# EAGLE schematic naiLED_eagle (EAGLE 7.1.0)
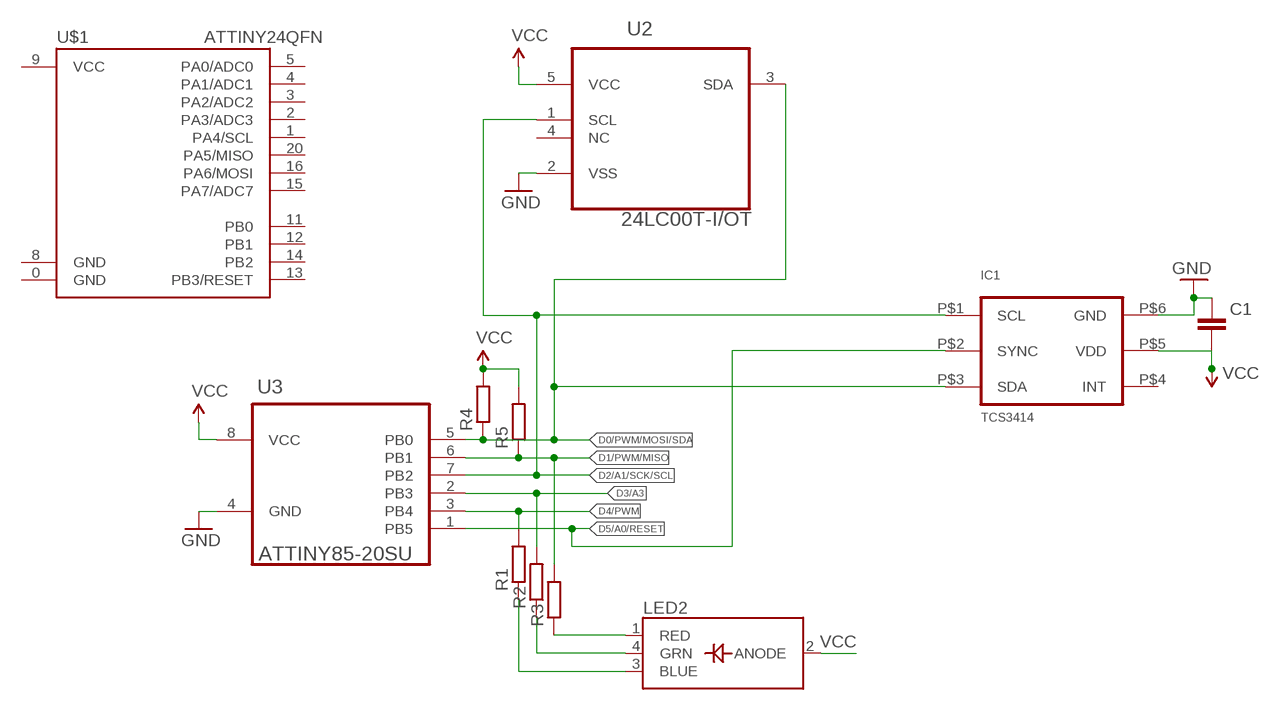
[diagram p0: schematic, sheet 1]

## Parts
C1  CAPACITOR_NPOL-0402  [C402]
IC1  TCS3414  [DFN-6PIN]
LED2  LED_RGB_PLCC4  [RGBLED_PLCC4]
R1  RESISTOR-0402  [R402]
R2  RESISTOR-0402  [R402]
R3  RESISTOR-0402  [R402]
R4  RESISTOR-0402  [R402]
R5  RESISTOR-0402  [R402]
U2  24LC00T-I/OT  [SOT95P290X145-5N]
U3  ATTINY85-20SU  [SOIC127P798X216-8N]
U$1  ATTINY24QFN  [QFN20]

## Nets
D0/PWM/MOSI/SDA: IC1.P$3(SDA) R4.1 U2.3(SDA) U3.5(PB0)
D1/PWM/MISO: R3.2 R5.1 U3.6(PB1)
D2/A1/SCK/SCL: IC1.P$1(SCL) U2.1(SCL) U3.7(PB2)
D3/A3: R2.2 U3.2(PB3)
D4/PWM: R1.2 U3.3(PB4)
D5/A0/RESET: IC1.P$2(SYNC) U3.1(PB5)
GND: C1.2 IC1.P$6(GND) U2.2(VSS) U3.4(GND)
N$1: LED2.1(RED) R3.1
N$2: LED2.4(GRN) R2.1
N$3: LED2.3(BLUE) R1.1
VCC: C1.1 IC1.P$5(VDD) LED2.2(ANODE) R4.2 R5.2 U2.5(VCC) U3.8(VCC)
Unconnected: IC1.P$4(INT) U2.4(NC) U$1.0(GND) U$1.1(PA4/SCL) U$1.2(PA3/ADC3) U$1.3(PA2/ADC2) U$1.4(PA1/ADC1) U$1.5(PA0/ADC0) U$1.8(GND) U$1.9(VCC) U$1.11(PB0) U$1.12(PB1) U$1.13(PB3/RESET) U$1.14(PB2) U$1.15(PA7/ADC7) U$1.16(PA6/MOSI) U$1.20(PA5/MISO)

## Library data of the parts
C1 = dp_devices:CAPACITOR_NPOL: Non-Polarized capacitor in various packages
IC1 = yair_r:TCS3414: Color Light-to-Digital Converter With SYNC Input for Color Sensing Synchronization and In-Package IR Blocking Filter (CS Package Only) Vdd I2C http://www.ams.com/eng/content/download/250258/975997/TCS3404_TCS3414-A.pdf
LED2 = microbuilder:LED_RGB_PLCC4: RGB LED - PLCC4 Cree 20mA Common Anode Digikey: CLV1A-FKB-CJ1M1F1BB7R4S3CT-ND Red: 2.6V Vf, 550mcd Green: 3.2V Vf, 850mcd Blue: 3.2V Vf, 320mcd
R1-R5 = dp_devices:RESISTOR
U2 = Microchip-24LCxxx:24LC00T-I/OT: IC, EEPROM 128BIT SERIAL 400KHZ SOT-23-5; MPN: 24LC00T-I/OT; OC_FARNELL: 9757864; OC_NEWARK: 62K0574; PACKAGE: SOT-23-5; SUPPLIER: MICROCHIP
U3 = nld:ATTINY85-20SU: 8-bit Microcontroller with In-System Programmable Flash; MPN: ATTINY85-20SU; OC_FARNELL: 1455164; OC_NEWARK: 58M3797; PACKAGE: SOIC-8; SUPPLIER: Atmel
U$1 = SparkFun-DigitalIC:ATTINY24: Atmel 20-pin 2kB flash uC